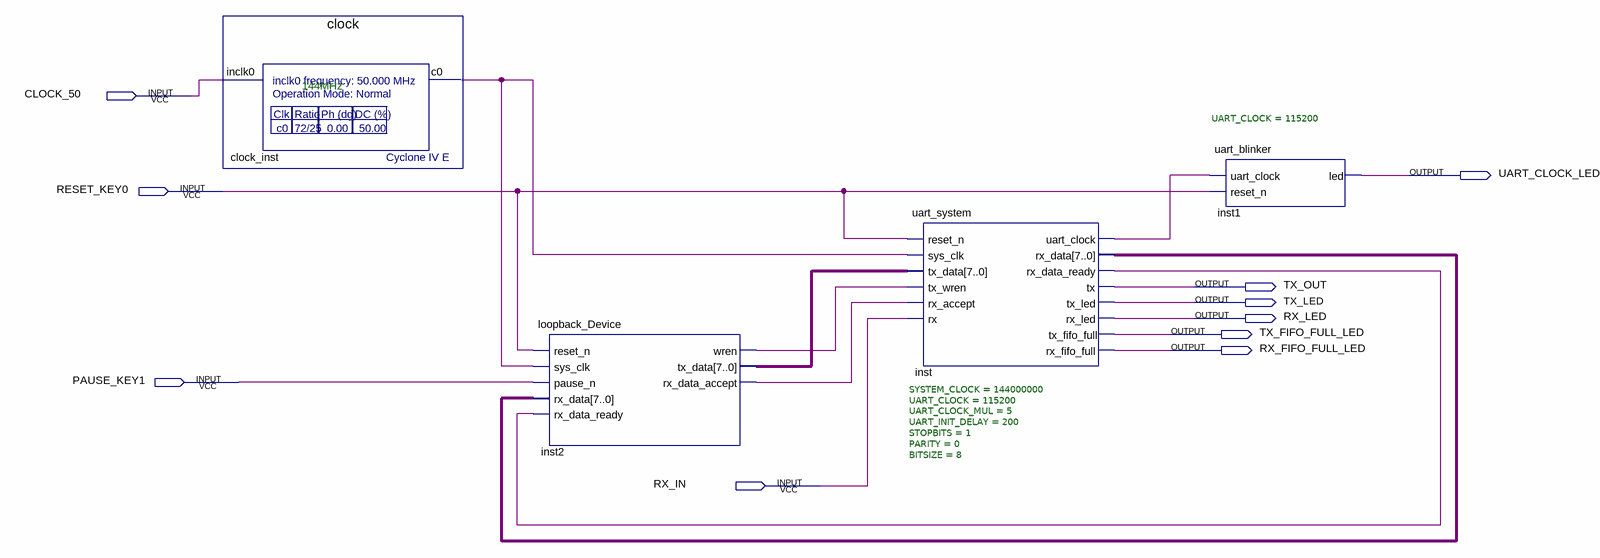
[diagram p0: schematic sheet]
// Quartus schematic loopback_test.bdf as structural Verilog: 4 symbols, 10 pins
module loopback_test (
  input  CLOCK_50,
  input  RESET_KEY0,
  input  PAUSE_KEY1,
  input  RX_IN,
  output UART_CLOCK_LED,
  output TX_OUT,
  output TX_LED,
  output RX_LED,
  output TX_FIFO_FULL_LED,
  output RX_FIFO_FULL_LED
);

  wire clock_inst_c0, inst2_rx_data_accept, inst2_wren, inst_rx_data_ready, inst_uart_clock;
  wire [7:0] inst2_tx_data, inst_rx_data;

  clock clock_inst (.inclk0(CLOCK_50), .c0(clock_inst_c0));
  loopback_Device inst2 (
    .reset_n(RESET_KEY0), .sys_clk(clock_inst_c0), .pause_n(PAUSE_KEY1), .rx_data(inst_rx_data),
    .rx_data_ready(inst_rx_data_ready), .wren(inst2_wren), .tx_data(inst2_tx_data),
    .rx_data_accept(inst2_rx_data_accept));
  uart_system #(.SYSTEM_CLOCK(144000000), .UART_CLOCK(115200), .UART_CLOCK_MUL(5), .UART_INIT_DELAY(200), .STOPBITS(1), .PARITY(0), .BITSIZE(8)) inst (
    .reset_n(RESET_KEY0), .sys_clk(clock_inst_c0), .tx_data(inst2_tx_data), .tx_wren(inst2_wren),
    .rx_accept(inst2_rx_data_accept), .rx(RX_IN), .uart_clock(inst_uart_clock), .rx_data(inst_rx_data),
    .rx_data_ready(inst_rx_data_ready), .tx(TX_OUT), .tx_led(TX_LED), .rx_led(RX_LED),
    .tx_fifo_full(TX_FIFO_FULL_LED), .rx_fifo_full(RX_FIFO_FULL_LED));
  uart_blinker #(.UART_CLOCK(115200)) inst1 (.uart_clock(inst_uart_clock), .reset_n(RESET_KEY0), .led(UART_CLOCK_LED));

  // Notes on the sheet:
  //   144MHz
endmodule
